# Altium schematic sheet UI.SchDoc
size B; SheetNumber: 7; SheetTotal: 7
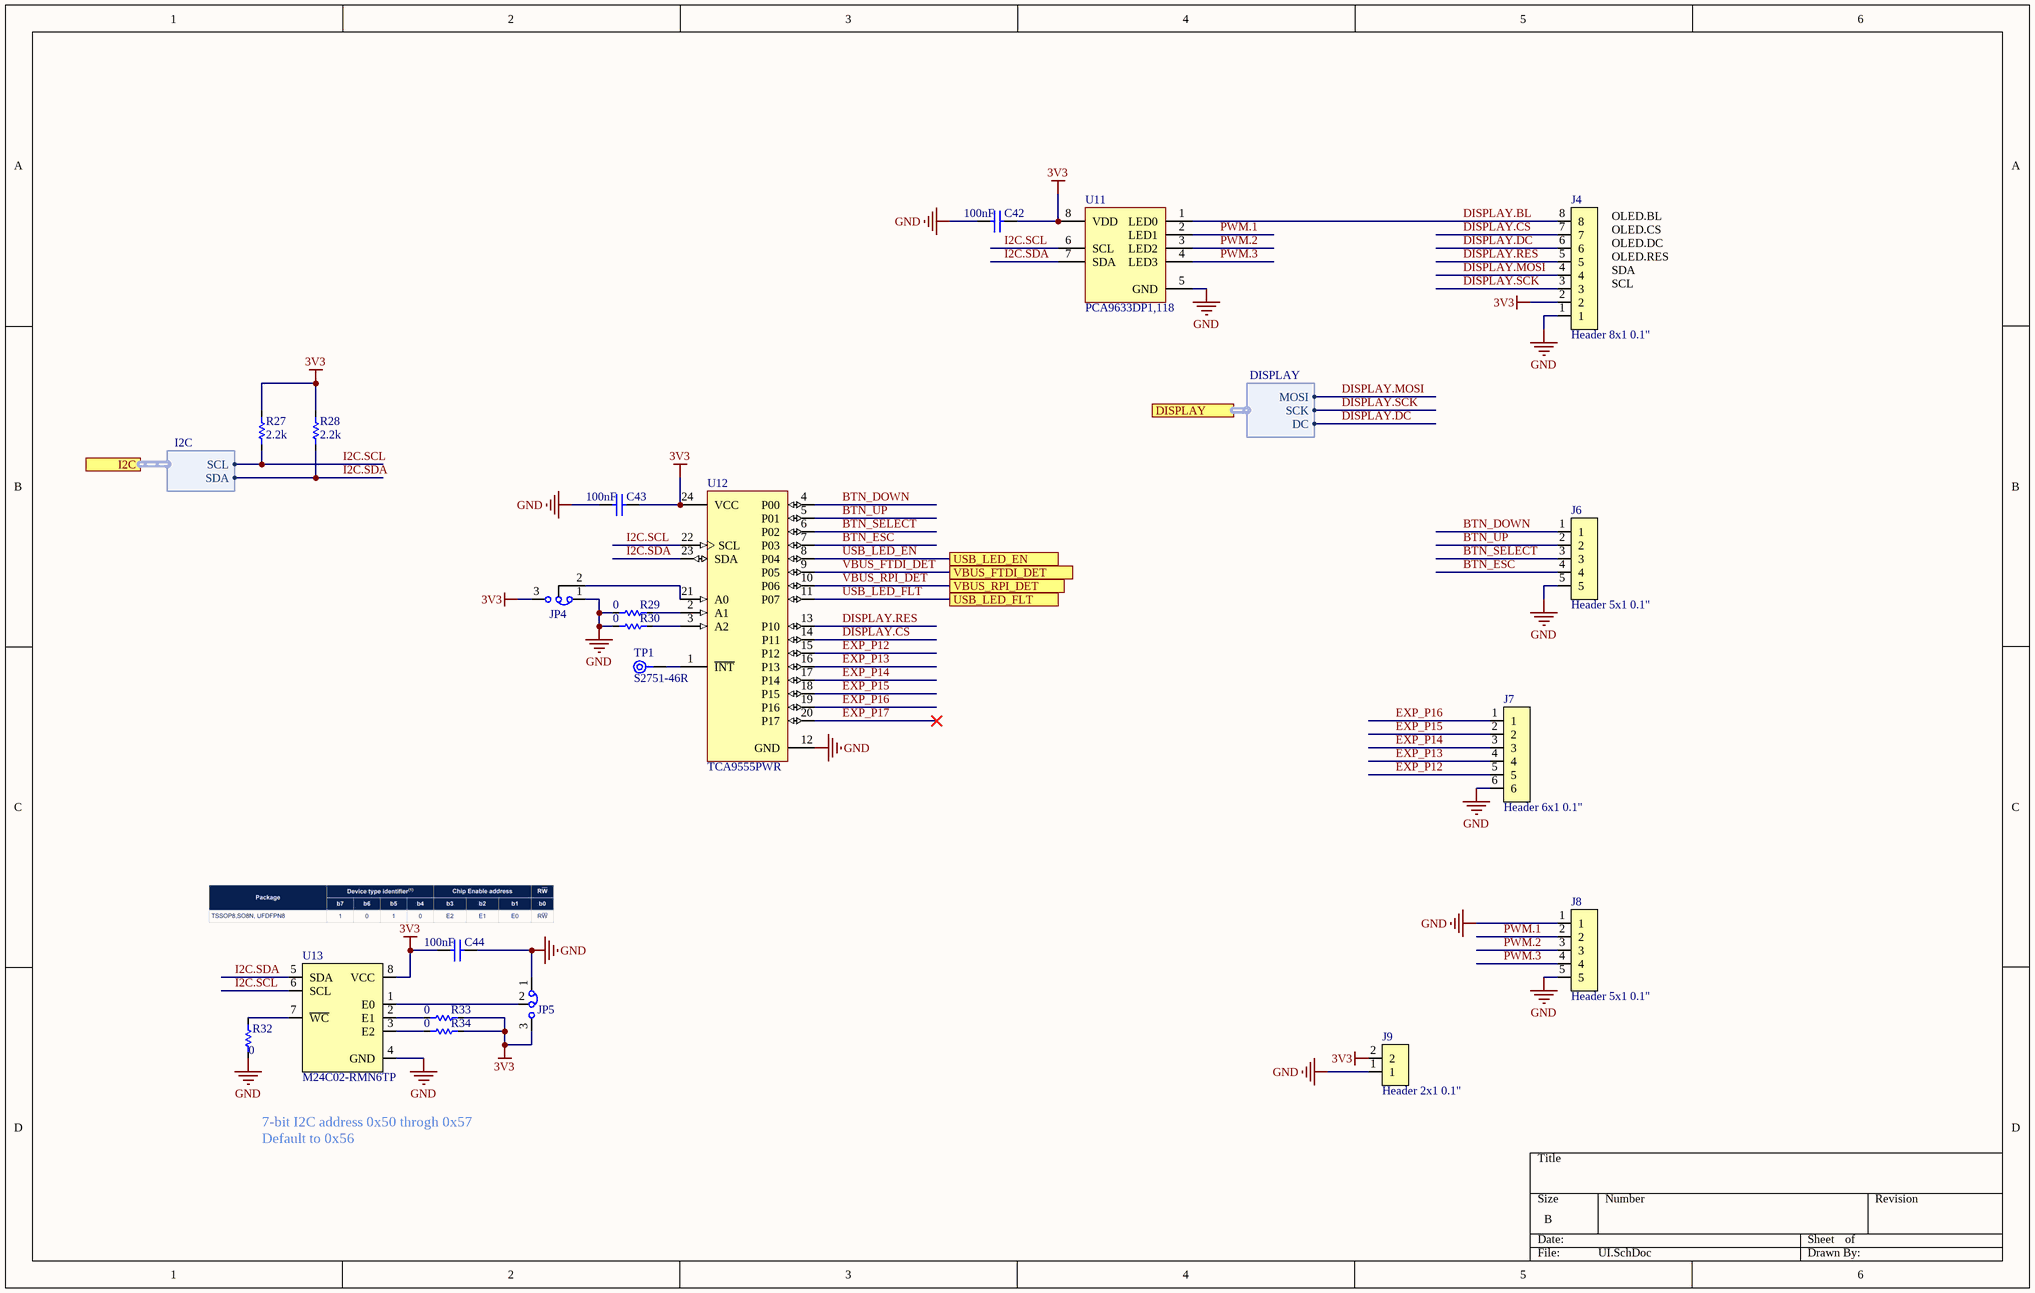
[diagram p0: UI.SchDoc]

## Parts
C42  value 100nF  [CAPC1608X10N_0603_MED]  (hidden comment: CC0603KRX7R0BB104)
C43  value 100nF  [CAPC1608X10N_0603_MED]  (hidden comment: CC0603KRX7R0BB104)
C44  value 100nF  [CAPC1608X10N_0603_MED]  (hidden comment: CC0603KRX7R0BB104)
J4  Header 8x1 0.1"  [HEADER 8x1 0.1"]
J6  Header 5x1 0.1"  [HEADER 5x1 0.1"]
J7  Header 6x1 0.1"  [Copy of HEADER 7x1 0.1"]
J8  Header 5x1 0.1"  [HEADER 5x1 0.1"]
J9  Header 2x1 0.1"  [FP-M20-9990245-MFG]
JP4  Jumper 3 x 1 Bridge 1-2 Solder Bridge  [Jumper 3 Solder Bridge 1-2 0603]  (value not drawn)
JP5  Jumper 3 x 1 Bridge 1-2 Solder Bridge  [Jumper 3 Solder Bridge 1-2 0603]  (value not drawn)
R27  value 2.2k  [RESC1608X06N_0603_MED]  (hidden comment: RC0603FR-072K2L)
R28  value 2.2k  [RESC1608X06N_0603_MED]  (hidden comment: RC0603FR-072K2L)
R29  value 0  [RESC1608X06N_0603_MED]  (hidden comment: RC0603FR-070RL)
R30  value 0  [RESC1608X06N_0603_MED]  (hidden comment: RC0603FR-070RL)
R32  value 0  [RESC1608X06N_0603_MED]  (hidden comment: RC0603FR-070RL)
R33  value 0  [RESC1608X06N_0603_MED]  (hidden comment: RC0603FR-070RL)
R34  value 0  [RESC1608X06N_0603_MED]  (hidden comment: RC0603FR-070RL)
TP1  S2751-46R  [S2751-46R]
U11  PCA9633DP1,118  [NXP-TSSOP-8_M]
U12  TCA9555PWR  [PW0024A_M]
U13  M24C02-RMN6TP  [M24C02-RMN6TP-SO8N-IPC_B]

## Ports
DISPLAY (harness DISPLAY), I2C (harness I2C), USB_LED_EN, USB_LED_FLT, VBUS_FTDI_DET, VBUS_RPI_DET

## Harnesses
DISPLAY: MOSI, DC, SCK
I2C: SCL, SDA

## Nets
3V3: C42.2 C43.2 C44.1 J4.2 J9.2 JP4.3 JP5.3 R27.2 R28.2 R33.1 R34.1 U11.8(VDD) U12.24(VCC) U13.8(VCC)
GND: C42.1 C43.1 C44.2 J4.1 J6.5 J7.6 J8.1 J8.5 J9.1 JP4.1 JP5.1 R29.2 R30.2 R32.2 U11.5(GND) U12.12(GND) U13.4(GND)
BTN_DOWN: J6.1 U12.4(P00)
BTN_ESC: J6.4 U12.7(P03)
BTN_SELECT: J6.3 U12.6(P02)
BTN_UP: J6.2 U12.5(P01)
DISPLAY.BL: J4.8 U11.1(LED0)
DISPLAY.CS: J4.7 U12.14(P11)
DISPLAY.DC: J4.6 ; port DISPLAY.DC
DISPLAY.MOSI: J4.4 ; port DISPLAY.MOSI
DISPLAY.RES: J4.5 U12.13(P10)
DISPLAY.SCK: J4.3 ; port DISPLAY.SCK
EXP_P12: J7.5 U12.15(P12)
EXP_P13: J7.4 U12.16(P13)
EXP_P14: J7.3 U12.17(P14)
EXP_P15: J7.2 U12.18(P15)
EXP_P16: J7.1 U12.19(P16)
EXP_P17: U12.20(P17)
I2C.SCL: R27.1 U11.6(SCL) U12.22(SCL) U13.6(SCL) ; port I2C.SCL
I2C.SDA: R28.1 U11.7(SDA) U12.23(SDA) U13.5(SDA) ; port I2C.SDA
PWM.1: J8.2 U11.2(LED1)
PWM.2: J8.3 U11.3(LED2)
PWM.3: J8.4 U11.4(LED3)
USB_LED_EN: U12.8(P04) ; port USB_LED_EN
USB_LED_FLT: U12.11(P07) ; port USB_LED_FLT
VBUS_FTDI_DET: U12.9(P05) ; port VBUS_FTDI_DET
VBUS_RPI_DET: U12.10(P06) ; port VBUS_RPI_DET
NetJP4_2: JP4.2 U12.21(A0)
NetJP5_2: JP5.2 U13.1(E0)
NetR29_1: R29.1 U12.2(A1)
NetR30_1: R30.1 U12.3(A2)
NetR32_1: R32.1 U13.7(~{WC})
NetR33_2: R33.2 U13.2(E1)
NetR34_2: R34.2 U13.3(E2)
NetTP1_1: TP1.1 U12.1(~{INT})

## Notes on the sheet
- (near J4) OLED.BL
  OLED.CS
  OLED.DC
  OLED.RES
  SDA
  SCL
- 7-bit I2C address 0x50 throgh 0x57
  Default to 0x56

## Library data of the parts
C42-C44 = CMP-001-00102-4: Ceramic Capacitor, Multilayer, Ceramic, 100V, 10% +Tol, 10% -Tol, X7R, 15% TC, 0.1uF, Surface Mount, 0603; Max Operating Temperature: 125°C; RoHS Compliant: Yes; Case/Package: 0603; Mounting Technology: Surface Mount; Capacitor Type: Ceramic; Pins: 2; Voltage Rating: 100V; Min Operating Temperature: -55°C; JLCPN: C113803
J4 = CMP-002-00240-1: Conn Header Vert 8POS 2.54MM; Gender: Male; Mounting Technology: THROUGH HOLE; Pins: 8; Connector Type: Header
J6 J8 = CMP-002-00239-1: Conn Header Vert 5POS 2.54MM; Gender: Male; Mounting Technology: Through Hole; Pins: 5; Connector Type: Header
J7 = CMP-002-00250-1: Conn Header Vert 6POS 2.54MM; Gender: Male; Pins: 6; Mounting Technology: Through Hole; Connector Type: Header
J9 = CMP-002-00082-2: Conn Header Vert 2POS 2.54MM; Connector Type: BOARD CONNECTOR; Min Operating Temperature: -40°C; Mounting Technology: Through Hole; Pins: 2; Max Operating Temperature: 105°C; RoHS Compliant: Yes
JP4 JP5 = CMP-009-00341-2: 0603 Solder Bridge Jumper Surface Mount; Tolerance: 1%; Voltage Rating: 75V; Value: 0; Pins: 2; Case/Package: 0603; RoHS Compliant: Yes; Max Operating Temperature: 155°C; Min Operating Temperature: -55°C; Mounting Technology: Surface Mount
R27 R28 = CMP-009-00304-2: Fixed Resistor, Metal Glaze/thick Film, 0.1W, 2200ohm, 75V, 1% +/-Tol, 100ppm/Cel, Surface Mount, 0603; Power: 100mW; Voltage Rating: 50V; Min Operating Temperature: -55°C; Max Operating Temperature: 155°C; Tolerance: 1%; Case/Package: 0603; Pins: 2; Mounting Technology: Surface Mount; RoHS Compliant: Yes; JLCPN: C114662
R29 R30 R32-R34 = CMP-009-00204-6: RC Series 0603 0.1 W 0 Ohm Jumper Surface Mount Thick Film Chip Resistor; Power: 100mW; Voltage Rating: 75V; Tolerance: 1%; Mounting Technology: Surface Mount; Pins: 2; Case/Package: 0603; Max Operating Temperature: 155°C; Min Operating Temperature: -55°C; RoHS Compliant: Yes; JLCPN: C21189
TP1 = CMP-00028-00009-4: Test Point; Pins: 1
U11 = CMP-015-00036-1: PCA9633 Series 25 mA 5.5 V 1 MHz SMT 8-bit I2C-Bus LED Driver - TSSOP-8; Max Supply Voltage: 5.5V; Min Supply Voltage: 2.3V; Case/Package: TSSOP; Min Operating Temperature: -40°C; Max Operating Temperature: 85°C; Pins: 8
U12 = CMP-015-00012-2: 16-bit 1.65- to 5.5-V I2C/SMBus I/O expander with interrupt, weak pull-up & config registers; Nominal Supply Voltage: 1.8V; Min Supply Voltage: 1.65V; Max Supply Voltage: 5.5V; Min Operating Temperature: -40°C; RoHS Compliant: Yes; Case/Package: TSSOP; Pins: 24; Max Operating Temperature: 85°C
U13 = CMP-019-00078-2: M24C02 Series 2 Kb (256 x 8) 1.8 V SMT Serial I²C Bus EEPROM - SOIC-8; Max Supply Voltage: 5.5V; Min Supply Voltage: 1.8V; Frequency: 400kHz; Memory Size: 256B; Case/Package: SOIC; Pins: 8; Clock Frequency: 400kHz; Min Operating Temperature: -40°C; Memory Format: EEPROM; Max Operating Temperature: 85°C; Mounting Technology: Surface Mount; JLCPN: C83836